# Altium schematic sheet JACKS.SchDoc
size A4; SheetNumber: 11; SheetTotal: 13
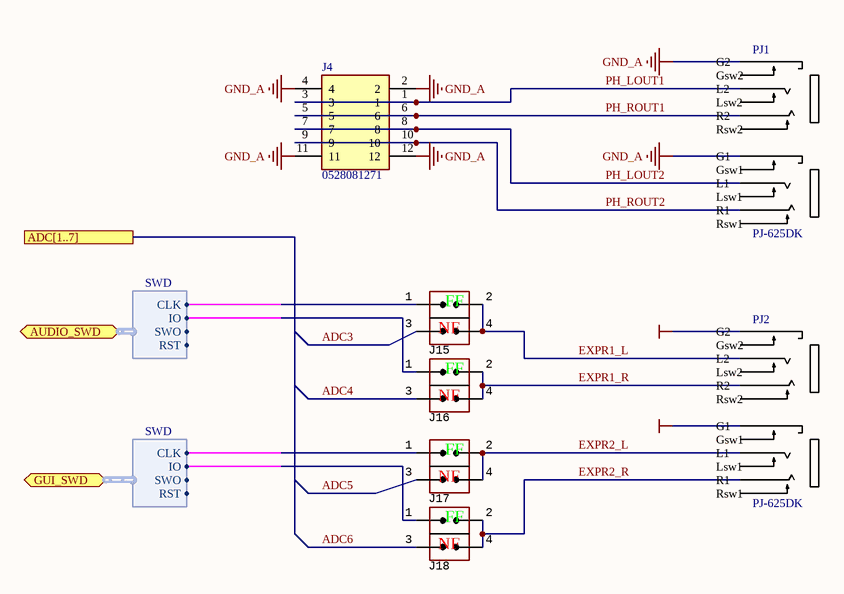
[diagram p0: JACKS.SchDoc]

## Parts
J4  0528081271  [AFA11-S12GLA-00]
J15  (no value)  [CON: JUMPER x2]
J16  (no value)  [CON: JUMPER x2]
J17  (no value)  [CON: JUMPER x2]
J18  (no value)  [CON: JUMPER x2]
PJ1  PJ-625DK  [PJ-625CK]
PJ2  PJ-625DK  [PJ-625CK]

## Ports
ADC[1..7], AUDIO_SWD (bidir, harness SWD), GUI_SWD (bidir, harness SWD)

## Harnesses
SWD: CLK, IO, SWO, RST

## Nets
GND: PJ2.2(G1) PJ2.22(G2)
GND_A: J4.2 J4.4 J4.11 J4.12 PJ1.2(G1) PJ1.22(G2)
ADC3: J15.3(IN)
ADC4: J16.3(IN)
ADC5: J17.3(IN)
ADC6: J18.3(IN)
EXPR1_L: J15.2(IN) J15.4(IN) PJ2.26(L2)
EXPR1_R: J16.2(IN) J16.4(IN) PJ2.24(R2)
EXPR2_L: J17.2(IN) J17.4(IN) PJ2.6(L1)
EXPR2_R: J18.2(IN) J18.4(IN) PJ2.4(R1)
PH_LOUT1: J4.1 J4.3 PJ1.26(L2)
PH_LOUT2: J4.7 J4.8 PJ1.6(L1)
PH_ROUT1: J4.5 J4.6 PJ1.24(R2)
PH_ROUT2: J4.9 J4.10 PJ1.4(R1)
NetJ15_1: J15.1(IN) ; port AUDIO_SWD.CLK
NetJ16_1: J16.1(IN) ; port AUDIO_SWD.IO
NetJ17_1: J17.1(IN) ; port GUI_SWD.CLK
NetJ18_1: J18.1(IN) ; port GUI_SWD.IO

Not connected (* = marked no-connect by the designer): PJ1 3(Gsw1) 5(Rsw1) 7(Lsw1) 23(Gsw2) 25(Rsw2) 27(Lsw2); PJ2 3(Gsw1) 5(Rsw1) 7(Lsw1) 23(Gsw2) 25(Rsw2) 27(Lsw2)

## Notes on the sheet
- (near J15) FF
- (near J15) NF
- (near J16) FF
- (near J16) NF
- (near J17) FF
- (near J17) NF
- (near J18) NF
- (near J18) FF

## Library data of the parts
J4 = 0528081271: Connector; Manufacturer_Name: Molex; Datasheet Link: https://www.molex.com/pdm_docs/sd/528082071_sd.pdf; Height: 5.3mm; Manufacturer_Part_Number: 0528081271; System: Connector
J15-J18 = Jumper_double: CommentText: "Перемычка"
PJ1 PJ2 = PJ-625DK: 6.3mm jack HOOYA